# Altium schematic sheet WiFi.SchDoc
size A; SheetNumber: 7; SheetTotal: 7
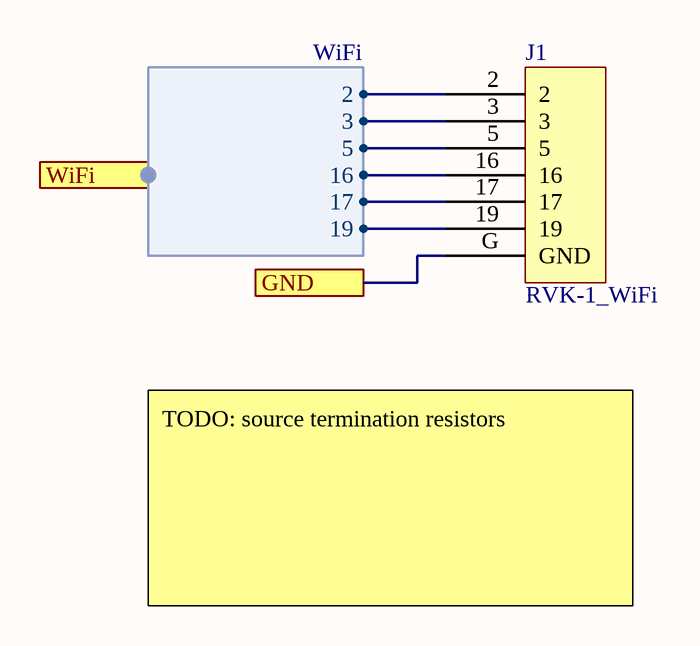
[diagram p0: WiFi.SchDoc]

## Parts
J1  RVK-1_WiFi  [RVK-1_WiFi_Vias]

## Ports
GND, WiFi (harness WiFi)

## Harnesses
WiFi: 2, 3, 5, 16, 17, 19

## Nets
GND: J1.G(GND) ; port GND
NetJ1_2: J1.2 ; port WiFi.2
NetJ1_3: J1.3 ; port WiFi.3
NetJ1_5: J1.5 ; port WiFi.5
NetJ1_16: J1.16 ; port WiFi.16
NetJ1_17: J1.17 ; port WiFi.17
NetJ1_19: J1.19 ; port WiFi.19

## Notes on the sheet
- TODO: source termination resistors